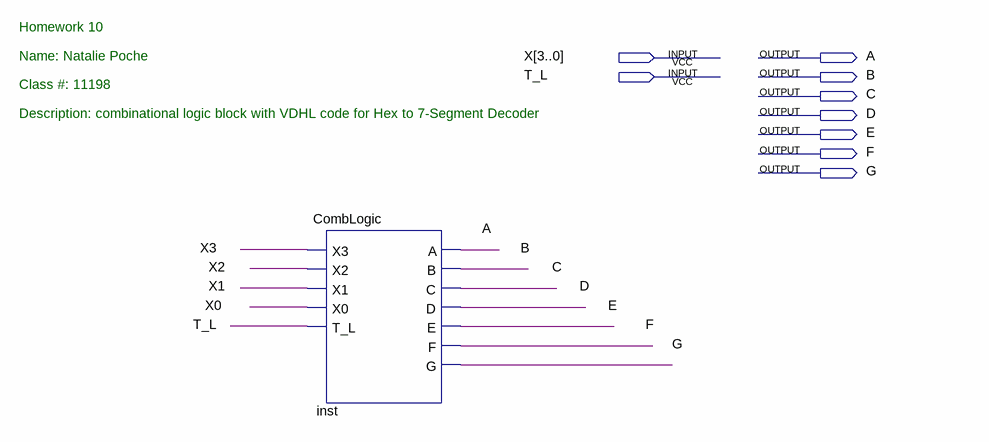
[diagram p0: schematic sheet]
// Quartus schematic hw10.bdf as structural Verilog: 1 symbols, 9 pins
module hw10 (
  input  [3:0] X,
  input  T_L,
  output A,
  output B,
  output C,
  output D,
  output E,
  output F,
  output G
);

  CombLogic inst (
    .X3(X[3]), .X2(X[2]), .X1(X[1]), .X0(X[0]), .T_L(T_L), .A(A), .B(B), .C(C), .D(D), .E(E), .F(F), .G(G));

  // Notes on the sheet:
  //   Homework 10
  //   Name: Natalie Poche
  //   Class #: 11198
  //   Description: combinational logic block with VDHL code for Hex to 7-Segment Decoder
endmodule
